# Altium schematic sheet Power.SchDoc
size 381 x 241 mm; SheetNumber: 3; SheetTotal: 8
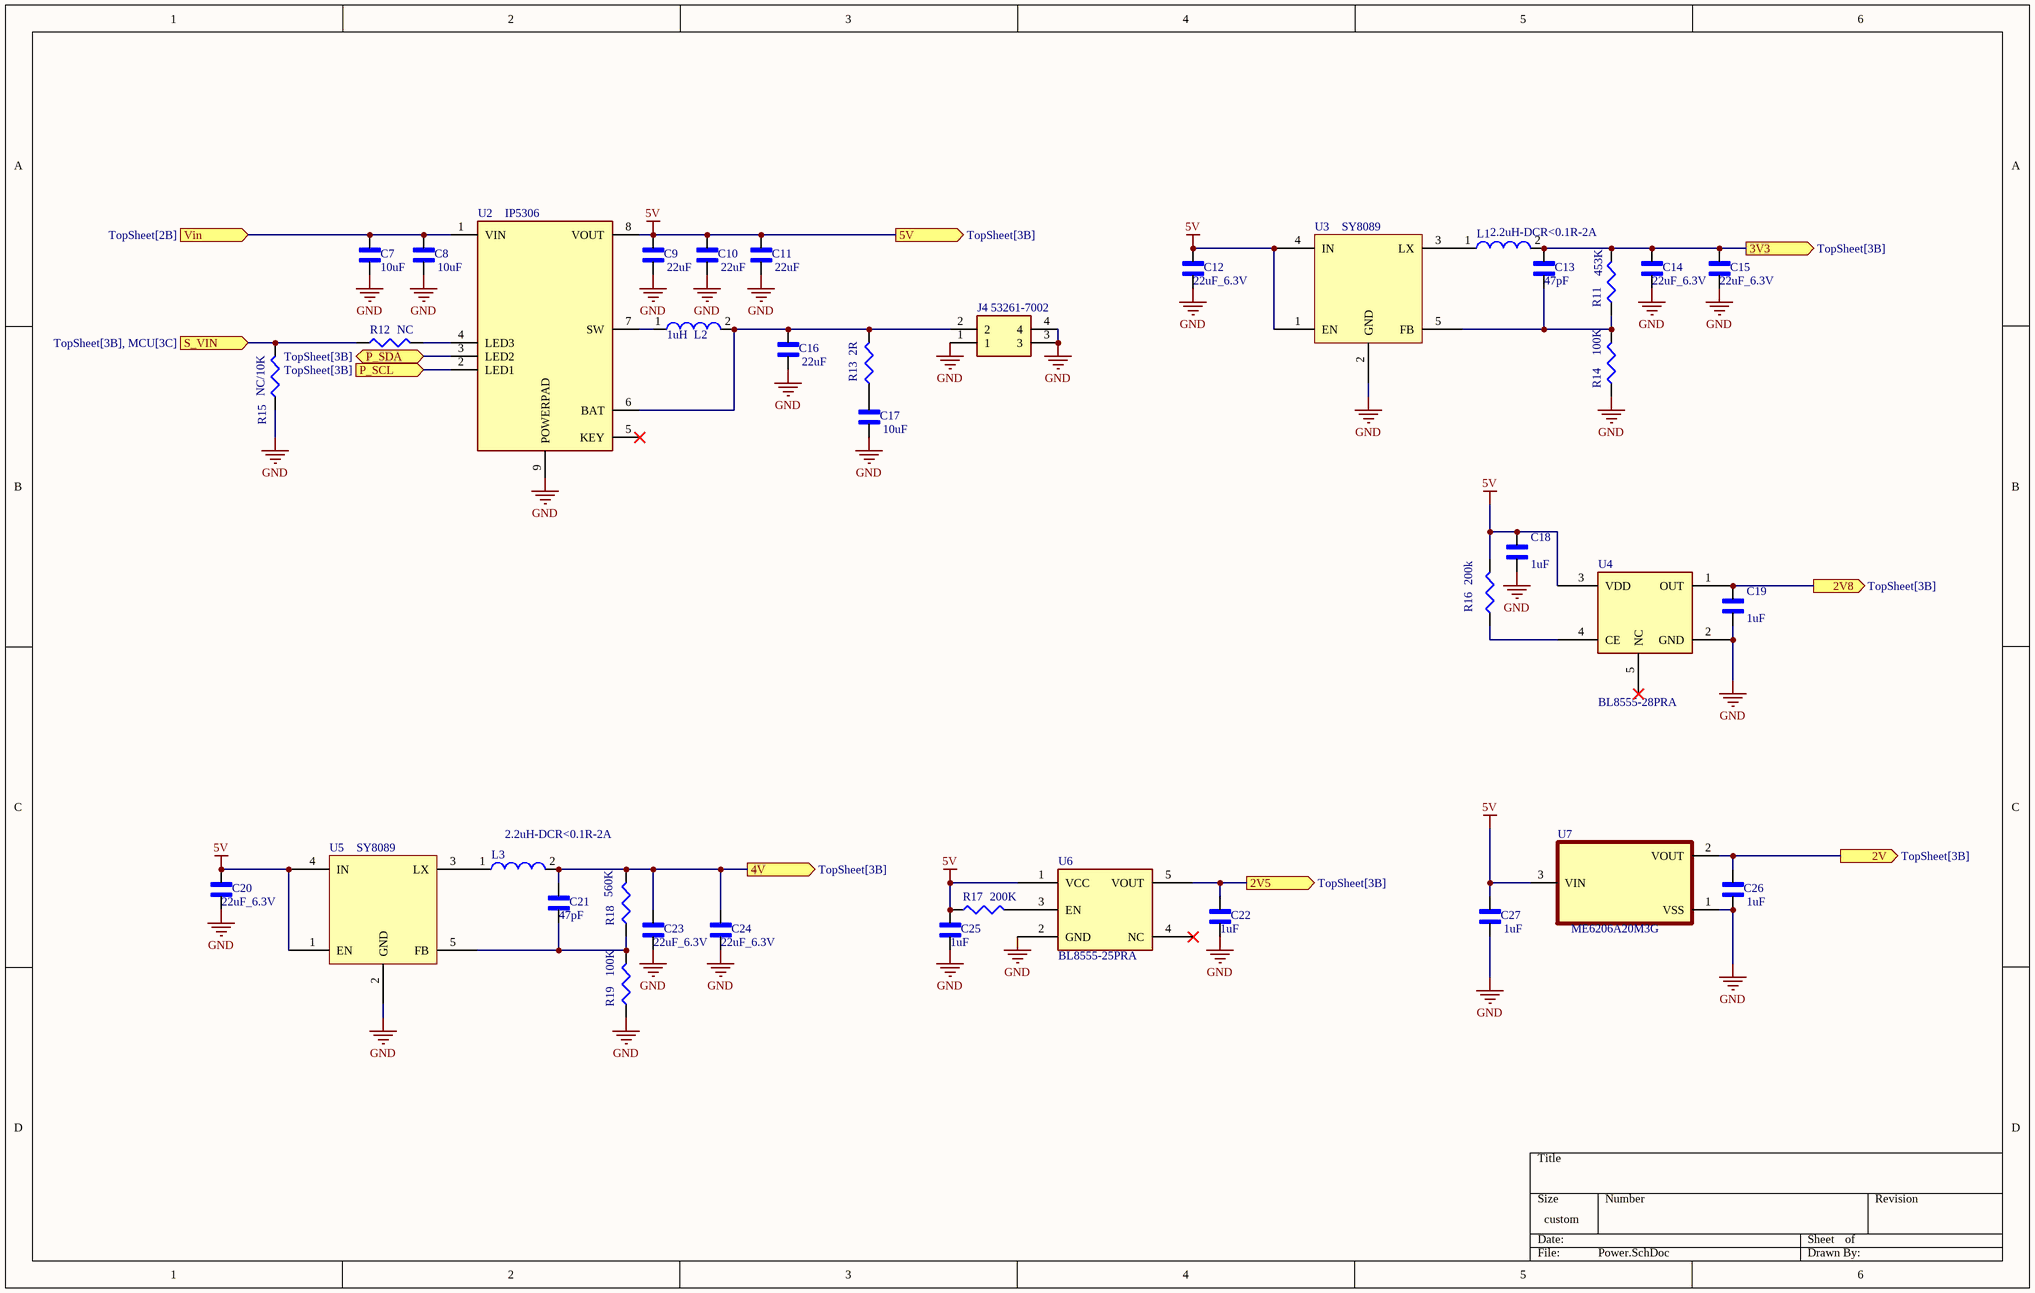
[diagram p0: Power.SchDoc]

## Parts
C7  10uF  [C0805]
C8  10uF  [C0805]
C9  22uF  [C0805]
C10  22uF  [C0805]
C11  22uF  [C0805]
C12  22uF_6.3V  [C0805]
C13  47pF  [C0603]
C14  22uF_6.3V  [C0805]
C15  22uF_6.3V  [C0805]
C16  22uF  [C0805]
C17  10uF  [C0805]
C18  1uF  [C0603]
C19  1uF  [C0603]
C20  22uF_6.3V  [C0805]
C21  47pF  [C0603]
C22  1uF  [C0805]
C23  22uF_6.3V  [C0805]
C24  22uF_6.3V  [C0805]
C25  1uF  [C0805]
C26  1uF  [C0603]
C27  1uF  [C0603]
J4  53261-7002  [532617002]
L1  2.2uH-DCR<0.1R-2A  [4.0 mm × 4.0 mm]
L2  1uH  [4.0 mm × 4.0 mm]
L3  2.2uH-DCR<0.1R-2A  [4.0 mm × 4.0 mm]
R11  453K  [R0603]
R12  NC  [R0603]
R13  2R  [R0805]
R14  100K  [R0603]
R15  NC/10K  [R0603]
R16  200k  [R0603]
R17  200K  [R0603]
R18  560K  [R0603]
R19  100K  [R0603]
U2  IP5306  [SOP127P600X165-9N]
U3  SY8089  [SOT95P280X145-5N]
U4  BL8555-28PRA  [TSOT-23_S5]
U5  SY8089  [SOT95P280X145-5N]
U6  BL8555-25PRA  [TSOT-23_S5]
U7  ME6206A20M3G  [SOT95P237X112-3N]

## Ports
2V5 (out, see TopSheet[3B]), 2V8 (out, see TopSheet[3B]), 2V (out, see TopSheet[3B]), 3V3 (out, see TopSheet[3B]), 4V (out, see TopSheet[3B]), 5V (out, see TopSheet[3B]), P_SCL (in, see TopSheet[3B]), P_SDA (bidir, see TopSheet[3B]), S_VIN (in, see TopSheet[3B], MCU[3C]), Vin (in, see TopSheet[2B])

## Nets
5V: C9.2 C10.2 C11.2 C12.2 C18.2 C20.2 C25.2 C27.2 R16.2 R17.1 U2.8(VOUT) U3.1(EN) U3.4(IN) U4.3(VDD) U5.1(EN) U5.4(IN) U6.1(VCC) U7.3(VIN) ; port 5V
GND: C7.1 C8.1 C9.1 C10.1 C11.1 C12.1 C14.1 C15.1 C16.1 C17.1 C18.1 C19.1 C20.1 C22.1 C23.1 C24.1 C25.1 C26.1 C27.1 J4.1 J4.3 J4.4 R14.1 R15.1 R19.1 U2.9(POWERPAD) U3.2(GND) U4.2(GND) U5.2(GND) U6.2(GND) U7.1(VSS)
2V: C26.2 U7.2(VOUT) ; port 2V
2V5: C22.2 U6.5(VOUT) ; port 2V5
2V8: C19.2 U4.1(OUT) ; port 2V8
3V3: C13.2 C14.2 C15.2 L1.2 R11.2 ; port 3V3
4V: C21.2 C23.2 C24.2 L3.2 R18.2 ; port 4V
P_SCL: U2.2(LED1) ; port P_SCL
P_SDA: U2.3(LED2) ; port P_SDA
S_VIN: R12.1 R15.2 ; port S_VIN
Vin: C7.2 C8.2 U2.1(VIN) ; port Vin
NetC13_1: C13.1 R11.1 R14.2 U3.5(FB)
NetC16_2: C16.2 J4.2 L2.2 R13.2 U2.6(BAT)
NetC17_2: C17.2 R13.1
NetC21_1: C21.1 R18.1 R19.2 U5.5(FB)
NetL1_1: L1.1 U3.3(LX)
NetL2_1: L2.1 U2.7(SW)
NetL3_1: L3.1 U5.3(LX)
NetR12_2: R12.2 U2.4(LED3)
NetR16_1: R16.1 U4.4(CE)
NetR17_2: R17.2 U6.3(EN)

Not connected (* = marked no-connect by the designer): U2 5(KEY)*; U4 5(NC)*; U6 4(NC)*

## Library data of the parts
C7-C27 = Capacitor non polar: This Non-Polarized Capacitor Design Library provides accurate schematic symbols and IPC-compliant PCB footprints for standard non-polarized capacitors, including MLCCs (ceramic capacitors) in common SMD sizes like 0402, 0603, 0805,1206 and 1210.; MF: Murata; MP: GJM1555C1HR10BB01J; SnapEDA_Link: https://www.snapeda.com/parts/GJM1555C1HR10BB01J/Murata/view-part/?ref=snap; Package: 1005 Taiyo Yuden; Check_prices: https://www.snapeda.com/parts/GJM1555C1HR10BB01J/Murata/view-part/?ref=eda
  C7 C8 C17: VALUE: 10uF
  C9-C11 C16: VALUE: 22uF
  C12 C14 C15 C20 C23 C24: VALUE: 22uF_6.3V
  C13 C21: VALUE: 47pF
  C18 C19 C22 C25-C27: VALUE: 1uF
J4 = 53261-7002: Headers & Wire Housings PicoBlade SMT RA PKG 0.38 GOLD 2P; Manufacturer_Name: Molex; Geometry.Height: 3.4mm; Mouser Part Number: 538-53261-7002; Mouser Price/Stock: https://www.mouser.co.uk/ProductDetail/Molex/53261-7002?qs=0lSvoLzn4L%2F9TYfu1Dmicg%3D%3D; Manufacturer_Part_Number: 53261-7002; Datasheet Link: https://www.molex.com/pdm_docs/sd/532617002_sd.pdf
L1-L3 = Inductor: SMD Inductor Generic; PartNumber: 744043152; Inductance: 1500 µH; DatasheetVersion: ver 6, Aug-2010; PackageReference: WE-TPC-4828-MH; PackageDescription: SMD Inductor, 2-Leads, Body 4.8 x 4.8 mm; ComponentLink1Description: Manufacturer URL; ComponentLink1URL: http://www.we-online.com; ComponentLink2Description: Datasheet; ComponentLink2URL: http://www.we-online.de/katalog/media/pdf/744043152.pdf
R11-R19 = Resistor: This Library provides a comprehensive set of schematic symbols and PCB footprints for standard resistor packages (e.g., 0402, 0603, 0805, 1206).
U2 = IP5306: Fully-Integrated Power Bank System-On-Chip with 2.1A charger, 2.4A discharger; MF: Injoinic; SnapEDA_Link: https://www.snapeda.com/parts/IP5306/Injoinic/view-part/?ref=snap; Package: SOIC-4 INJOINIC; Value: *; MP: IP5306; Check_prices: https://www.snapeda.com/parts/IP5306/Injoinic/view-part/?ref=eda
U3 U5 = SY8089A1
U4 = BL8555-28PRA: BL8555-28PRA   2.8 V regulator; MF: Analog Devices; MP: LT1722CS5#TRMPBF; SnapEDA_Link: https://www.snapeda.com/parts/LT1722CS5%23TRMPBF/Analog+Devices/view-part/?ref=snap; Package: SOT-5 Analog Devices; Value: *; Check_prices: https://www.snapeda.com/parts/LT1722CS5%23TRMPBF/Analog+Devices/view-part/?ref=eda
U6 = BL8555-25PRA: BL8555-25PRA   2.5 V regulator; MF: Analog Devices; MP: LT1722CS5#TRMPBF; SnapEDA_Link: https://www.snapeda.com/parts/LT1722CS5%23TRMPBF/Analog+Devices/view-part/?ref=snap; Package: SOT-5 Analog Devices; Value: *; Check_prices: https://www.snapeda.com/parts/LT1722CS5%23TRMPBF/Analog+Devices/view-part/?ref=eda
U7 = ME6206A20M3G: 2V regulator MICRONE(Nanjing Micro One Elec) ME6206A20M3G; MF: Analog Devices; MP: MAX6006BEUR+T; SnapEDA_Link: https://www.snapeda.com/parts/MAX6006BEUR+T/Analog+Devices/view-part/?ref=snap; Package: SOT-23-3 Maxim Integrated; Value: *; Check_prices: https://www.snapeda.com/parts/MAX6006BEUR+T/Analog+Devices/view-part/?ref=eda